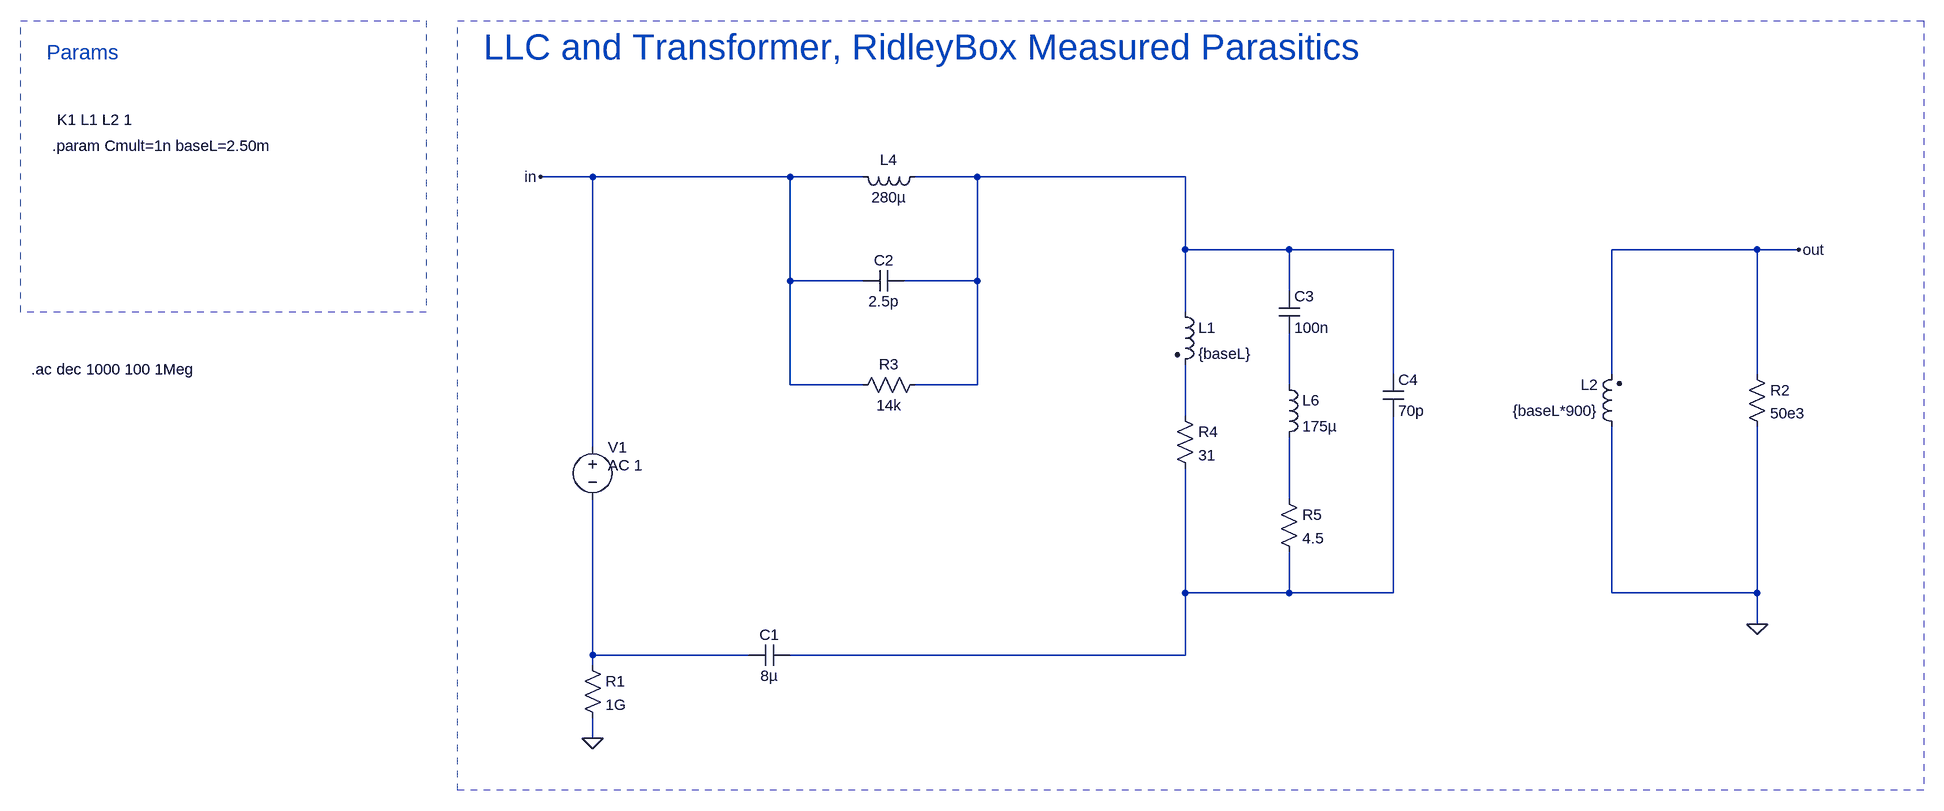
[diagram p0: schematic LLC_Parasitics.asc]
LLC_Parasitics.asc, the LTspice schematic file:
Version 4.1
SHEET 1 2872 1204
WIRE 208 -64 128 -64
WIRE 512 -64 208 -64
WIRE 624 -64 512 -64
WIRE 800 -64 704 -64
WIRE 1120 -64 800 -64
WIRE 1120 48 1120 -64
WIRE 1280 48 1120 48
WIRE 1440 48 1280 48
WIRE 2000 48 1776 48
WIRE 2064 48 2000 48
WIRE 512 96 512 -64
WIRE 624 96 512 96
WIRE 800 96 800 -64
WIRE 800 96 688 96
WIRE 1280 112 1280 48
WIRE 1120 144 1120 48
WIRE 1440 240 1440 48
WIRE 1776 240 1776 48
WIRE 2000 240 2000 48
WIRE 512 256 512 96
WIRE 624 256 512 256
WIRE 800 256 800 96
WIRE 800 256 704 256
WIRE 1280 256 1280 176
WIRE 1120 304 1120 224
WIRE 208 352 208 -64
WIRE 1280 432 1280 336
WIRE 1120 576 1120 384
WIRE 1280 576 1280 512
WIRE 1280 576 1120 576
WIRE 1440 576 1440 304
WIRE 1440 576 1280 576
WIRE 1776 576 1776 320
WIRE 2000 576 2000 320
WIRE 2000 576 1776 576
WIRE 2000 624 2000 576
WIRE 208 672 208 432
WIRE 448 672 208 672
WIRE 1120 672 1120 576
WIRE 1120 672 512 672
WIRE 208 688 208 672
WIRE 208 800 208 768
FLAG 128 -64 in
FLAG 208 800 0
FLAG 2000 624 0
FLAG 2064 48 out
SYMBOL ind2 1792 336 R180
WINDOW 0 36 80 Left 2
WINDOW 3 36 40 Left 2
SYMATTR InstName L2
SYMATTR Value {baseL*900}
SYMATTR Type ind
SYMBOL ind2 1104 128 R0
SYMATTR InstName L1
SYMATTR Value {baseL}
SYMATTR Type ind
SYMATTR SpiceLine Rser=0
SYMBOL cap 512 656 R90
WINDOW 0 0 32 VBottom 2
WINDOW 3 32 32 VTop 2
SYMATTR InstName C1
SYMATTR Value 8µ
SYMBOL voltage 208 336 R0
WINDOW 3 24 152 Left 2
WINDOW 123 24 44 Left 2
WINDOW 39 0 0 Left 0
SYMATTR Value ""
SYMATTR Value2 AC 1
SYMATTR InstName V1
SYMBOL res 192 672 R0
SYMATTR InstName R1
SYMATTR Value 1G
SYMBOL res 1984 224 R0
SYMATTR InstName R2
SYMATTR Value 50e3
SYMBOL ind 720 -80 R90
WINDOW 0 5 56 VBottom 2
WINDOW 3 32 56 VTop 2
SYMATTR InstName L4
SYMATTR Value 280µ
SYMATTR SpiceLine Rser=1m
SYMBOL cap 688 80 R90
WINDOW 0 0 32 VBottom 2
WINDOW 3 32 32 VTop 2
SYMATTR InstName C2
SYMATTR Value 2.5p
SYMBOL res 720 240 R90
WINDOW 0 0 56 VBottom 2
WINDOW 3 32 56 VTop 2
SYMATTR InstName R3
SYMATTR Value 14k
SYMBOL cap 1264 112 R0
SYMATTR InstName C3
SYMATTR Value 100n
SYMBOL res 1104 288 R0
SYMATTR InstName R4
SYMATTR Value 31
SYMBOL ind 1264 240 R0
SYMATTR InstName L6
SYMATTR Value 175µ
SYMATTR SpiceLine Rser=0
SYMBOL res 1264 416 R0
SYMATTR InstName R5
SYMATTR Value 4.5
SYMBOL cap 1424 240 R0
SYMATTR InstName C4
SYMATTR Value 70p
SYMATTR SpiceLine Rser=600
TEXT 40 -264 Left 5 ;LLC and Transformer, RidleyBox Measured Parasitics
TEXT -616 -152 Left 2 !K1 L1 L2 1
TEXT -624 -112 Left 2 !.param Cmult=1n baseL=2.50m
TEXT -632 -256 Left 3 ;Params
TEXT -656 232 Left 2 !.ac dec 1000 100 1Meg
RECTANGLE Normal -48 144 -672 -304 1
RECTANGLE Normal 2256 880 0 -304 1

The netlist it stands for:
* LLC_Parasitics.asc
L2 0 out {baseL*900}
L1 N001 N003 {baseL} Rser=0
C1 N005 N006 8µ
V1 in N006 AC 1
R1 N006 0 1G
R2 out 0 50e3
L4 N001 in 280µ Rser=1m
C2 N001 in 2.5p
R3 N001 in 14k
C3 N001 N002 100n
R4 N003 N005 31
L6 N002 N004 175µ Rser=0
R5 N004 N005 4.5
C4 N001 N005 70p Rser=600
* LLC and Transformer, RidleyBox Measured Parasitics
K1 L1 L2 1
.param Cmult=1n baseL=2.50m
* Params
.ac dec 1000 100 1Meg
.backanno
.end